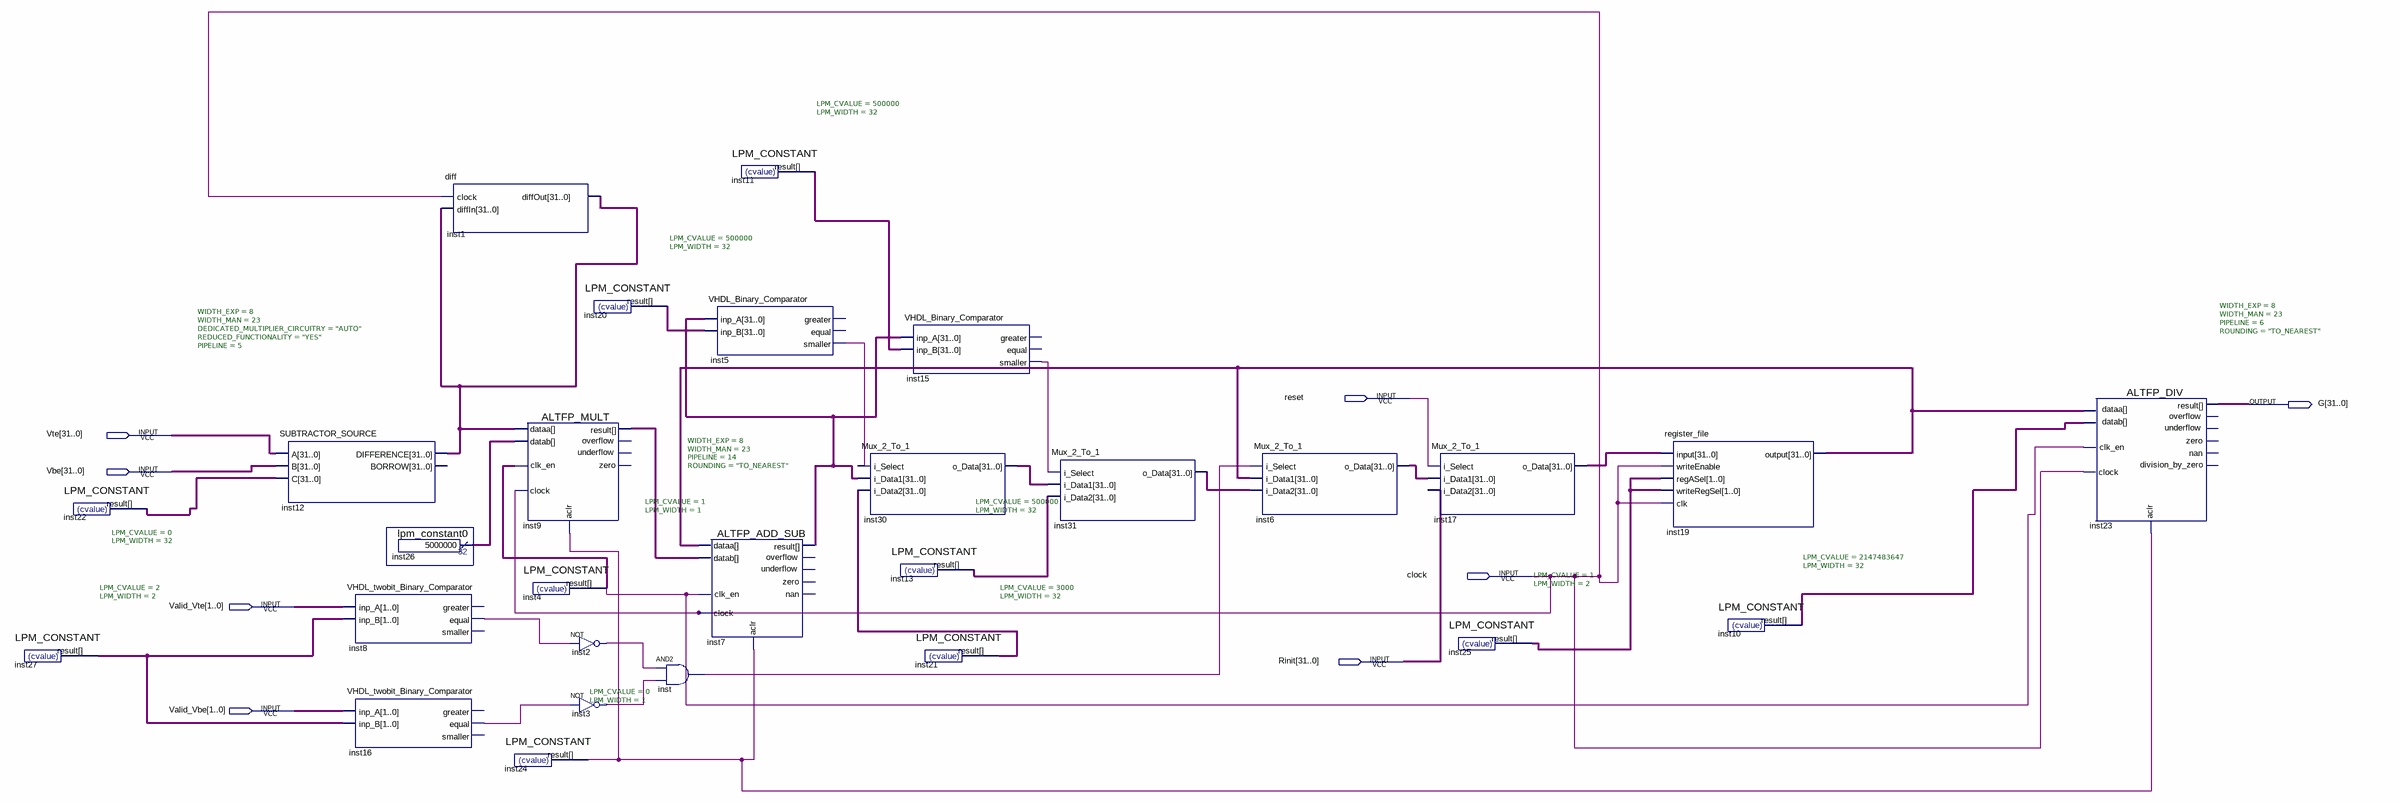
[diagram p0: schematic sheet]
// Quartus schematic Memristor_Model.bdf as structural Verilog: 28 symbols, 8 pins
module Memristor_Model (
  input  reset,
  input  [31:0] Vte,
  input  [31:0] Vbe,
  input  clock,
  input  [1:0] Valid_Vte,
  input  [31:0] Rinit,
  input  [1:0] Valid_Vbe,
  output [31:0] G
);

  wire inst2_out, inst3_out, inst4_result, inst5_smaller, inst8_equal, inst15_smaller, inst16_equal,
       inst24_result, inst_out;
  wire [1:0] inst25_result, inst27_result;
  wire [31:0] inst6_o_data, inst7_result, inst9_result, inst10_result, inst11_result, inst12_difference,
       inst13_result, inst17_o_data, inst19_output, inst20_result, inst21_result, inst22_result,
       inst26_result, inst30_o_data, inst31_o_data;

  LPM_CONSTANT #(.LPM_CVALUE(2), .LPM_WIDTH(2)) inst27 (.result(inst27_result));
  LPM_CONSTANT #(.LPM_CVALUE(0), .LPM_WIDTH(32)) inst22 (.result(inst22_result));
  SUBTRACTOR_SOURCE inst12 (.A(Vte), .B(Vbe), .C(inst22_result), .DIFFERENCE(inst12_difference));  // open: BORROW
  VHDL_twobit_Binary_Comparator inst8 (
    .inp_A(Valid_Vte), .inp_B(inst27_result), .equal(inst8_equal));  // open: greater, smaller
  VHDL_twobit_Binary_Comparator inst16 (
    .inp_A(Valid_Vbe), .inp_B(inst27_result), .equal(inst16_equal));  // open: greater, smaller
  lpm_constant0 inst26 (.result(inst26_result));
  diff inst1 (.clock(clock), .diffIn(inst12_difference), .diffOut(inst12_difference));
  ALTFP_MULT #(.WIDTH_EXP(8), .WIDTH_MAN(23), .DEDICATED_MULTIPLIER_CIRCUITRY("AUTO"), .REDUCED_FUNCTIONALITY("YES"), .PIPELINE(5)) inst9 (
    .aclr(inst24_result), .clk_en(inst4_result), .clock(clock), .dataa(inst12_difference),
    .datab(inst26_result), .result(inst9_result));  // open: overflow, underflow, zero
  LPM_CONSTANT #(.LPM_CVALUE(0), .LPM_WIDTH(1)) inst24 (.result(inst24_result));
  LPM_CONSTANT #(.LPM_CVALUE(1), .LPM_WIDTH(1)) inst4 (.result(inst4_result));
  LPM_CONSTANT #(.LPM_CVALUE(500000), .LPM_WIDTH(32)) inst20 (.result(inst20_result));
  not inst2 (inst2_out, inst8_equal);
  not inst3 (inst3_out, inst16_equal);
  and inst (inst_out, inst2_out, inst3_out);
  VHDL_Binary_Comparator inst5 (
    .inp_A(inst7_result), .inp_B(inst20_result), .smaller(inst5_smaller));  // open: greater, equal
  ALTFP_ADD_SUB #(.WIDTH_EXP(8), .WIDTH_MAN(23), .PIPELINE(14), .ROUNDING("TO_NEAREST")) inst7 (
    .aclr(inst24_result), .clk_en(inst4_result), .clock(clock), .dataa(inst19_output), .datab(inst9_result),
    .result(inst7_result));  // open: nan, overflow, underflow, zero
  LPM_CONSTANT #(.LPM_CVALUE(500000), .LPM_WIDTH(32)) inst11 (.result(inst11_result));
  Mux_2_To_1 inst30 (.i_Select(inst5_smaller), .i_Data1(inst7_result), .i_Data2(inst21_result), .o_Data(inst30_o_data));
  VHDL_Binary_Comparator inst15 (
    .inp_A(inst7_result), .inp_B(inst11_result), .smaller(inst15_smaller));  // open: greater, equal
  LPM_CONSTANT #(.LPM_CVALUE(500000), .LPM_WIDTH(32)) inst13 (.result(inst13_result));
  LPM_CONSTANT #(.LPM_CVALUE(3000), .LPM_WIDTH(32)) inst21 (.result(inst21_result));
  Mux_2_To_1 inst31 (
    .i_Select(inst15_smaller), .i_Data1(inst30_o_data), .i_Data2(inst13_result), .o_Data(inst31_o_data));
  Mux_2_To_1 inst6 (.i_Select(inst_out), .i_Data1(inst19_output), .i_Data2(inst31_o_data), .o_Data(inst6_o_data));
  Mux_2_To_1 inst17 (.i_Select(reset), .i_Data1(inst6_o_data), .i_Data2(Rinit), .o_Data(inst17_o_data));
  LPM_CONSTANT #(.LPM_CVALUE(1), .LPM_WIDTH(2)) inst25 (.result(inst25_result));
  register_file inst19 (
    .\input (inst17_o_data), .writeEnable(clock), .regASel(inst25_result), .writeRegSel(inst25_result),
    .clk(clock), .\output (inst19_output));
  LPM_CONSTANT #(.LPM_CVALUE(2147483647), .LPM_WIDTH(32)) inst10 (.result(inst10_result));
  ALTFP_DIV #(.WIDTH_EXP(8), .WIDTH_MAN(23), .PIPELINE(6), .ROUNDING("TO_NEAREST")) inst23 (
    .aclr(inst24_result), .clk_en(inst4_result), .clock(clock), .dataa(inst19_output), .datab(inst10_result),
    .result(G));  // open: division_by_zero, nan, overflow, underflow, zero
endmodule
